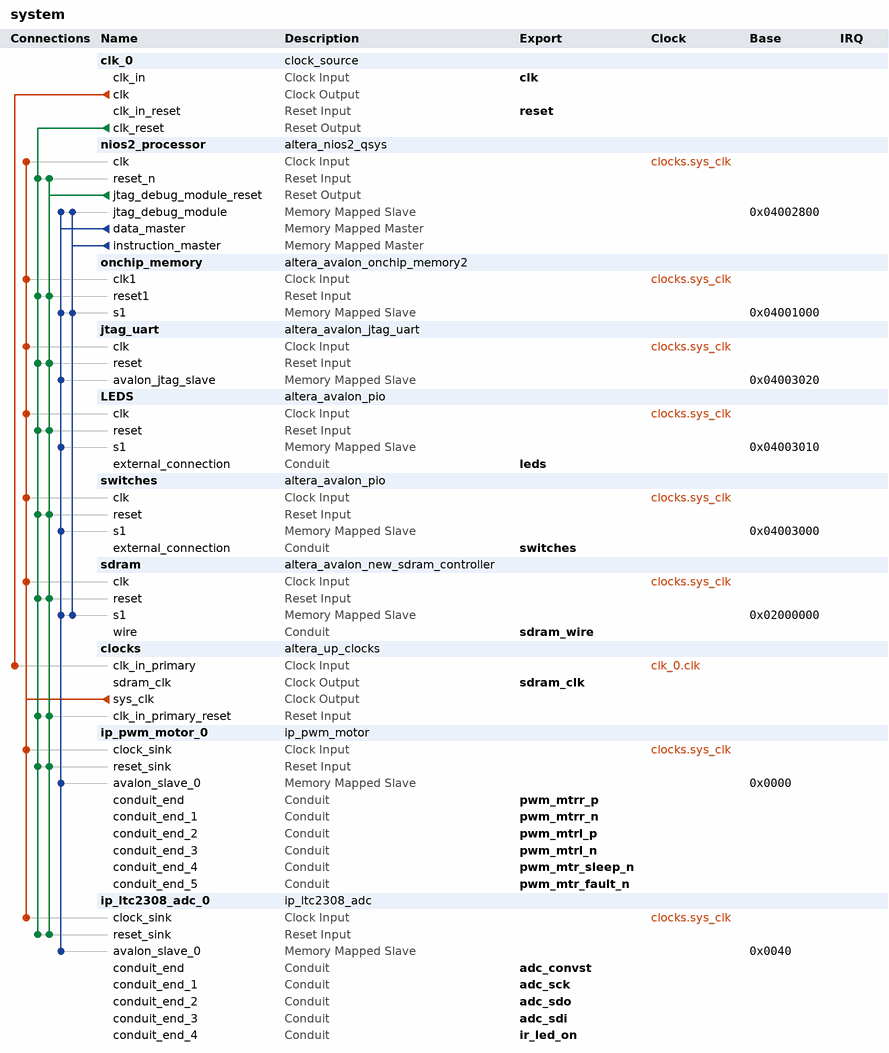
[diagram p0: system contents]
# Platform Designer (Qsys) system system, Cyclone IV E EP4CE22F17C6
# Parameters at their usual value, and those the tool derives, are not listed.
package require -exact qsys 13.0.1.99.2
create_system system
set_project_property DEVICE_FAMILY {Cyclone IV E}
set_project_property DEVICE EP4CE22F17C6

add_instance clk_0 clock_source 13.0
set_instance_parameter_value clk_0 clockFrequency 50000000

add_instance nios2_processor altera_nios2_qsys 13.0
set_instance_parameter_value nios2_processor resetSlave sdram.s1
set_instance_parameter_value nios2_processor mmu_TLBMissExcSlave None
set_instance_parameter_value nios2_processor exceptionSlave sdram.s1
set_instance_parameter_value nios2_processor breakSlave nios2_processor.jtag_debug_module
set_instance_parameter_value nios2_processor impl Tiny
set_instance_parameter_value nios2_processor icache_size 4096

add_instance onchip_memory altera_avalon_onchip_memory2 13.0.1.99.2
set_instance_parameter_value onchip_memory dataWidth 32
set_instance_parameter_value onchip_memory dualPort false
set_instance_parameter_value onchip_memory initMemContent true
set_instance_parameter_value onchip_memory initializationFileName onchip_mem.hex
set_instance_parameter_value onchip_memory memorySize 4096

add_instance jtag_uart altera_avalon_jtag_uart 13.0.1.99.2
set_instance_parameter_value jtag_uart simInteractiveOptions NO_INTERACTIVE_WINDOWS

add_instance LEDS altera_avalon_pio 13.0.1.99.2
set_instance_parameter_value LEDS direction Output
set_instance_parameter_value LEDS width 8

add_instance switches altera_avalon_pio 13.0.1.99.2
set_instance_parameter_value switches direction Input
set_instance_parameter_value switches width 8

add_instance sdram altera_avalon_new_sdram_controller 13.0.1.99.2
set_instance_parameter_value sdram TAC 5.5
set_instance_parameter_value sdram TRCD 20.0
set_instance_parameter_value sdram TRP 20.0
set_instance_parameter_value sdram casLatency 3
set_instance_parameter_value sdram columnWidth 9
set_instance_parameter_value sdram dataWidth 16
set_instance_parameter_value sdram generateSimulationModel false
set_instance_parameter_value sdram model single_Micron_MT48LC4M32B2_7_chip
set_instance_parameter_value sdram numberOfBanks 4
set_instance_parameter_value sdram numberOfChipSelects 1
set_instance_parameter_value sdram powerUpDelay 100.0
set_instance_parameter_value sdram refreshPeriod 15.625
set_instance_parameter_value sdram rowWidth 13

add_instance clocks altera_up_clocks 13.0
set_instance_parameter_value clocks board DE0-Nano
set_instance_parameter_value clocks vga_clk false
set_instance_parameter_value clocks audio_clk true
set_instance_parameter_value clocks audio_clk_freq 12.288

add_instance ip_pwm_motor_0 ip_pwm_motor 1.0

add_instance ip_ltc2308_adc_0 ip_ltc2308_adc 1.0

# connections
add_connection clk_0.clk clocks.clk_in_primary clock
add_connection clocks.sys_clk ip_ltc2308_adc_0.clock_sink clock
add_connection clocks.sys_clk ip_pwm_motor_0.clock_sink clock
add_connection clocks.sys_clk jtag_uart.clk clock
add_connection clocks.sys_clk LEDS.clk clock
add_connection clocks.sys_clk nios2_processor.clk clock
add_connection clocks.sys_clk onchip_memory.clk1 clock
add_connection clocks.sys_clk sdram.clk clock
add_connection clocks.sys_clk switches.clk clock
add_connection clk_0.clk_reset clocks.clk_in_primary_reset reset
add_connection clk_0.clk_reset ip_ltc2308_adc_0.reset_sink reset
add_connection clk_0.clk_reset ip_pwm_motor_0.reset_sink reset
add_connection clk_0.clk_reset jtag_uart.reset reset
add_connection clk_0.clk_reset LEDS.reset reset
add_connection clk_0.clk_reset nios2_processor.reset_n reset
add_connection clk_0.clk_reset onchip_memory.reset1 reset
add_connection clk_0.clk_reset sdram.reset reset
add_connection clk_0.clk_reset switches.reset reset
add_connection nios2_processor.jtag_debug_module_reset clocks.clk_in_primary_reset reset
add_connection nios2_processor.jtag_debug_module_reset ip_ltc2308_adc_0.reset_sink reset
add_connection nios2_processor.jtag_debug_module_reset ip_pwm_motor_0.reset_sink reset
add_connection nios2_processor.jtag_debug_module_reset jtag_uart.reset reset
add_connection nios2_processor.jtag_debug_module_reset LEDS.reset reset
add_connection nios2_processor.jtag_debug_module_reset nios2_processor.reset_n reset
add_connection nios2_processor.jtag_debug_module_reset onchip_memory.reset1 reset
add_connection nios2_processor.jtag_debug_module_reset sdram.reset reset
add_connection nios2_processor.jtag_debug_module_reset switches.reset reset
add_connection nios2_processor.data_master ip_ltc2308_adc_0.avalon_slave_0 avalon
set_connection_parameter_value nios2_processor.data_master/ip_ltc2308_adc_0.avalon_slave_0 baseAddress 0x0040
add_connection nios2_processor.data_master ip_pwm_motor_0.avalon_slave_0 avalon
set_connection_parameter_value nios2_processor.data_master/ip_pwm_motor_0.avalon_slave_0 baseAddress 0x0000
add_connection nios2_processor.data_master jtag_uart.avalon_jtag_slave avalon
set_connection_parameter_value nios2_processor.data_master/jtag_uart.avalon_jtag_slave baseAddress 0x04003020
add_connection nios2_processor.data_master LEDS.s1 avalon
set_connection_parameter_value nios2_processor.data_master/LEDS.s1 baseAddress 0x04003010
add_connection nios2_processor.data_master nios2_processor.jtag_debug_module avalon
set_connection_parameter_value nios2_processor.data_master/nios2_processor.jtag_debug_module baseAddress 0x04002800
add_connection nios2_processor.data_master onchip_memory.s1 avalon
set_connection_parameter_value nios2_processor.data_master/onchip_memory.s1 baseAddress 0x04001000
add_connection nios2_processor.data_master sdram.s1 avalon
set_connection_parameter_value nios2_processor.data_master/sdram.s1 baseAddress 0x02000000
add_connection nios2_processor.data_master switches.s1 avalon
set_connection_parameter_value nios2_processor.data_master/switches.s1 baseAddress 0x04003000
add_connection nios2_processor.instruction_master nios2_processor.jtag_debug_module avalon
set_connection_parameter_value nios2_processor.instruction_master/nios2_processor.jtag_debug_module baseAddress 0x04002800
add_connection nios2_processor.instruction_master onchip_memory.s1 avalon
set_connection_parameter_value nios2_processor.instruction_master/onchip_memory.s1 baseAddress 0x04001000
add_connection nios2_processor.instruction_master sdram.s1 avalon
set_connection_parameter_value nios2_processor.instruction_master/sdram.s1 baseAddress 0x02000000

# exported interfaces
add_interface leds conduit end
set_interface_property leds EXPORT_OF LEDS.external_connection
add_interface switches conduit end
set_interface_property switches EXPORT_OF switches.external_connection
add_interface clk clock sink
set_interface_property clk EXPORT_OF clk_0.clk_in
add_interface reset reset sink
set_interface_property reset EXPORT_OF clk_0.clk_in_reset
add_interface sdram_wire conduit end
set_interface_property sdram_wire EXPORT_OF sdram.wire
add_interface sdram_clk clock source
set_interface_property sdram_clk EXPORT_OF clocks.sdram_clk
add_interface pwm_mtrr_p conduit end
set_interface_property pwm_mtrr_p EXPORT_OF ip_pwm_motor_0.conduit_end
add_interface pwm_mtrr_n conduit end
set_interface_property pwm_mtrr_n EXPORT_OF ip_pwm_motor_0.conduit_end_1
add_interface pwm_mtrl_p conduit end
set_interface_property pwm_mtrl_p EXPORT_OF ip_pwm_motor_0.conduit_end_2
add_interface pwm_mtrl_n conduit end
set_interface_property pwm_mtrl_n EXPORT_OF ip_pwm_motor_0.conduit_end_3
add_interface pwm_mtr_sleep_n conduit end
set_interface_property pwm_mtr_sleep_n EXPORT_OF ip_pwm_motor_0.conduit_end_4
add_interface pwm_mtr_fault_n conduit end
set_interface_property pwm_mtr_fault_n EXPORT_OF ip_pwm_motor_0.conduit_end_5
add_interface adc_convst conduit end
set_interface_property adc_convst EXPORT_OF ip_ltc2308_adc_0.conduit_end
add_interface adc_sck conduit end
set_interface_property adc_sck EXPORT_OF ip_ltc2308_adc_0.conduit_end_1
add_interface adc_sdo conduit end
set_interface_property adc_sdo EXPORT_OF ip_ltc2308_adc_0.conduit_end_2
add_interface adc_sdi conduit end
set_interface_property adc_sdi EXPORT_OF ip_ltc2308_adc_0.conduit_end_3
add_interface ir_led_on conduit end
set_interface_property ir_led_on EXPORT_OF ip_ltc2308_adc_0.conduit_end_4

set_interconnect_requirement {$system} qsys_mm.clockCrossingAdapter HANDSHAKE
set_interconnect_requirement {$system} qsys_mm.maxAdditionalLatency 1

save_system system.qsys
